# Altium schematic sheet power-dist.SchDoc
size A
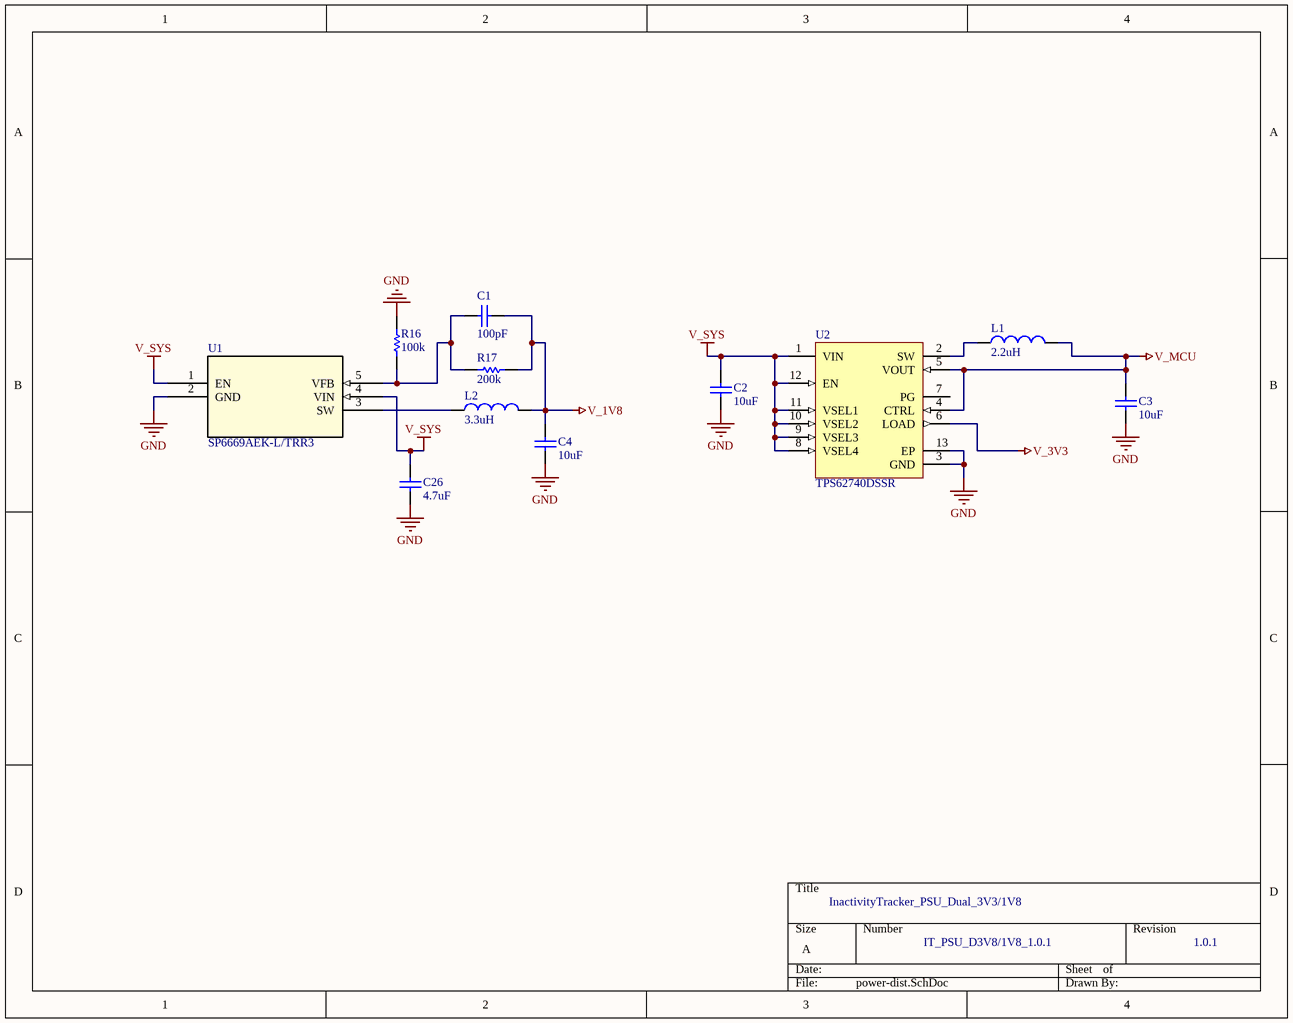
[diagram p0: power-dist.SchDoc]

## Parts
C1  100pF  [CAPC1005X55X25ML05T10]
C2  10uF  [CAPC1005X55X25NL05T10]
C3  10uF  [CAPC1005X55X25NL05T10]
C4  10uF  [CAPC1005X55X25NL05T10]
C26  4.7uF  [CAPC1005X55X25NL05T10]
L1  2.2uH  [MURA-IND0805_H_0.55_L]
L2  3.3uH  [INDC2012X100N]
R16  100k  [RESC1005X40X25ML05T05]
R17  200k  [RESC1005X40X25ML05T05]
U1  SP6669AEK-L/TRR3  [SOT-23-5_VAR-AA]
U2  TPS62740DSSR  [DSS0012A_V]

## Nets
GND: C2.2 C3.2 C4.2 C26.2 R16.1 U1.2(GND) U2.3(GND) U2.13(EP)
V_1V8: C1.2 C4.1 L2.2 R17.2
V_3V3: U2.6(LOAD)
V_MCU: C3.1 L1.2 U2.4(CTRL) U2.5(VOUT)
V_SYS: C2.1 C26.1 U1.1(EN) U1.4(VIN) U2.1(VIN) U2.8(VSEL4) U2.9(VSEL3) U2.10(VSEL2) U2.11(VSEL1) U2.12(EN)
NetC1_1: C1.1 R16.2 R17.1 U1.5(VFB)
NetL1_1: L1.1 U2.2(SW)
NetL2_1: L2.1 U1.3(SW)

Not connected (* = marked no-connect by the designer): U2 7(PG)

## Notes on the sheet
- InactivityTracker_PSU_Dual_3V3/1V8
- IT_PSU_D3V8/1V8_1.0.1
- 1.0.1

## Library data of the parts
C1 = CMP-2008-04249-1: Manufacturer: Murata; Part Number: GRM1555C1H101GA01D
C2-C4 = CMP-2008-04556-1: Part Number: GRM155R61A105KE15D; Manufacturer: Murata
C26 = CMP-2008-03967-1: Manufacturer: Murata; Part Number: GRM155R61C102KA01D
L1 = CMP-2000-06589-1: Chip Inductor, 1.0 uH, +/- 20%, -55 to 125 degC, 2-Pin SMD (0805), RoHS, Tape and Reel; Manufacturer: Murata; Rated Current-Max: 800mA; Inductance-Nom: 1H; DC Resistance: 0.19; Mounting Technology: SurfaceMount; Package Reference: 0805; Tolerance (%): 20%; Datasheet Version: 07/2014; Manufacturer URL: http://www.murata.com/; Package Description: 2-Pin Surface Mounted Device, Body 2 x 1.25 mm; Case Size/Dimension: 0805; Datasheet URL: https://datasheet.ciiva.com/3866/336lqm21pn1r0mc023-3866307.pdf
L2 = LQM21PN3R3NGRD: Inductor with Inductance: 3.3uH Tol. +/-30%, Package: 0805 _2012_; MF: Murata; Digi-Key_Purchase_URL: https://www.digikey.com/product-detail/en/murata-electronics/LQM21PN3R3NGRD/490-11718-1-ND/5333558?utm_source=snapeda&utm_medium=aggregator&utm_campaign=symbol; Value: *; Digi-Key_Part_Number: 490-11718-1-ND; SnapEDA_Link: https://www.snapeda.com/parts/LQM21PN3R3NGRD/Murata%20Electronics%20North%20America/view-part/1523369/?ref=snap; Package: 2012 Murata; MP: LQM21PN3R3NGRD
R16 = CMP-2002-08123-2: Chip Resistor, 100 KOhm, +/- 1%, 0.63 W, -55 to 155 degC, 0402 (1005 Metric), RoHS, Tape and Reel; Voltage Rating: 50 V; Type (Resistor): Thick Film; Power Rating: 63 mW; Case\Package: 0402; Mount: Surface Mount; Packaging: Tape and Reel; Weight: 2.3E-05 oz; PackageDescription: 2-Pin Surface Mount Device, Body 1 x 0.5 mm; ComponentLink1Description: Manufacturer URL; ComponentLink2Description: Datasheet; Min Operating Temperature: -55 degC; Width: 0.5 mm; Resistance: 100 kohm; REACH SVHC: Unknown; ComponentLink2URL: http://www.vishay.com/docs/20035/dcrcwe3.pdf; Package Quantity: 10000; Mounting Technology: Surface Mount; PackageReference: 0402; ComponentLink1URL: http://www.vishay.com/; Max Operating Temperature: 155 degC; Length: 1 mm; DatasheetVersion: 06/2012; Height: 0.35 mm; Case Code (Imperial): 0402; Pins: 2; Tolerance: 1%; Case Code (Metric): 1005; Radiation Hardening: No; RoHSCompliant: true
R17 = CMP-2002-08351-1: Part Number: CRCW0402200RFKED; Manufacturer: Vishay Dale
U1 = SP6669AEK-L/TRR3: Buck Switching Regulator IC Positive Adjustable 0.6V 1 Output 600mA SC-74A, SOT-753; Vendor: Exar; Built_By: EMA_Jessica; Manufacturer_Part_Number: SP6669AEK-L/TRR3; Copyright: Copyright (C) 2018 Accelerated Designs. All rights reserved; RefDes: RefDes; Type: DEV; Value: Value
U2 = CMP-0323-00572-2: Step Down Converter For Low Power Applications, 2.2 to 5.5 V VIN, -40 to 85 degC, 12-Pin WSON (DSS), RoHS, Tape and Reel; VOUT Max: 3.3 V; VIN Min: 2.2 V; VIN Max: 5.5 V; VOUT Min: 1.8 V; ComponentLink1URL: http://www.ti.com/; PackageReference: DSS0012A; ComponentLink2URL: http://www.ti.com/lit/ds/symlink/tps62740.pdf; Packing: Tape and Reel; DatasheetVersion: SLVSB02B; ComponentLink3Description: Package Specification; Temperature Max: 85 degC; RoHS: TRUE; PartNumber: TPS62740; PackageVersion: 4209244/C, 07/2011; PackageDescription: 12-Pin Plastic Small Outline, Body 3 x 2 mm, Pitch 0.5 mm; Mounting Technology: Surface Mount; ComponentLink1Description: Manufacturer URL; Temperature Min: -40 degC; ComponentLink2Description: Datasheet; ComponentLink3URL: http://www.ti.com/litv/pdf/mpds336b